# Altium schematic sheet DigitalV0.1.SchDoc
size A4; SheetNumber: 3; SheetTotal: 3
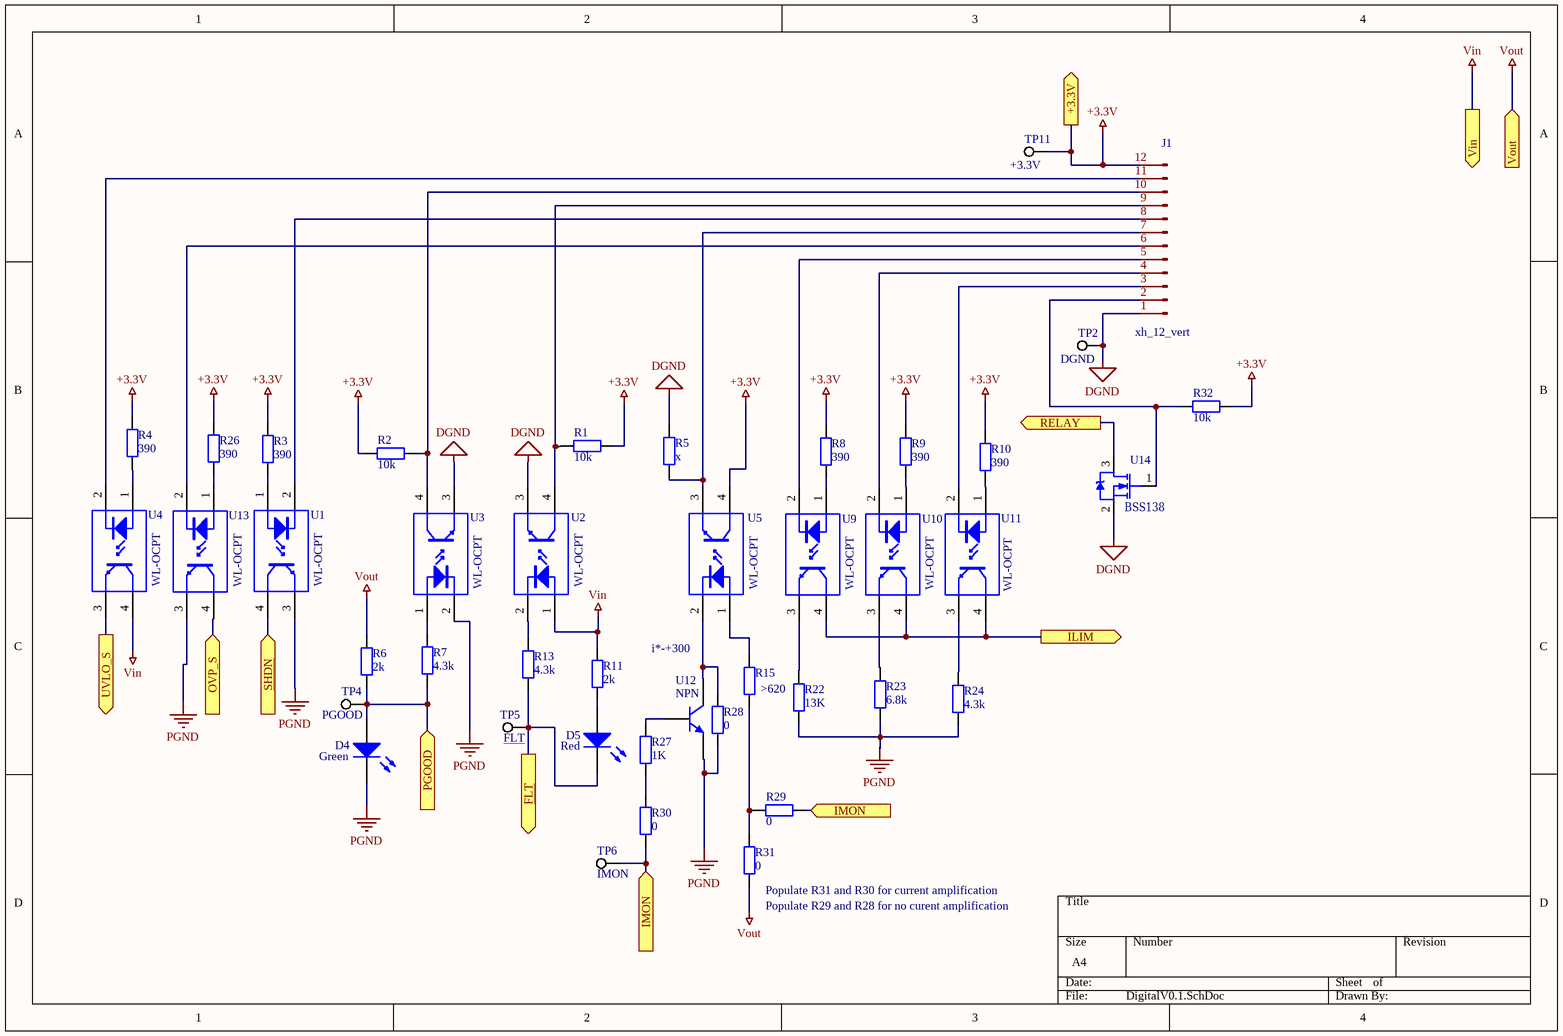
[diagram p0: DigitalV0.1.SchDoc]

## Parts
D4  Green  [0805 LED]
D5  Red  [0805 LED]
J1  xh_12_vert  [JST_XH_B12B-XH-A_1x12_P2.50mm_Vertical]
R1  10k  [0805]
R2  10k  [0805]
R3  390  [0805]
R4  390  [0805]
R5  x  [0805]
R6  2k  [0805]
R7  4.3k  [0805]
R8  390  [0805]
R9  390  [0805]
R10  390  [0805]
R11  2k  [0805]
R13  4.3k  [0805]
R15  >620  [0805]
R22  13K  [0805]
R23  6.8k  [0805]
R24  4.3k  [0805]
R26  390  [0805]
R27  1K  [0805]
R28  0  [0805]
R29  0  [0805]
R30  0  [0805]
R31  0  [0805]
R32  10k  [0805]
TP2  DGND  [Test Loop 1.6mm]
TP4  PGOOD  [Test Loop 1.6mm]
TP5  FLT  [Test Loop 1.6mm]
TP6  IMON  [Test Loop 1.6mm]
TP11  +3.3V  [Test Loop 1.6mm]
U1  WL-OCPT  [4-SOP_WE_opto-isolator]
U2  WL-OCPT  [4-SOP_WE_opto-isolator]
U3  WL-OCPT  [4-SOP_WE_opto-isolator]
U4  WL-OCPT  [4-SOP_WE_opto-isolator]
U5  WL-OCPT  [4-SOP_WE_opto-isolator]
U9  WL-OCPT  [4-SOP_WE_opto-isolator]
U10  WL-OCPT  [4-SOP_WE_opto-isolator]
U11  WL-OCPT  [4-SOP_WE_opto-isolator]
U12  NPN  [SOT23(TO-236AB)P095S230x290]
U13  WL-OCPT  [4-SOP_WE_opto-isolator]
U14  BSS138‎  [SOT-23-3]

## Ports
+3.3V (out), FLT (out), ILIM (out), IMON (in), OVP_S (in), PGOOD (in), RELAY (out), SHDN (in), UVLO_S (out), Vin (out), Vout (in)

## Nets
+3.3V: J1.12(Pin_11) R1.1 R2.1 R3.2 R4.2 R8.2 R9.2 R10.2 R26.2 R32.2 TP11.1 U5.4(C) ; port +3.3V
DGND: J1.1(Pin_1) R5.2 TP2.1 U2.3(E) U3.3(E) U14.2(D)
PGND: D4.2(K) R22.1 R23.1 R24.1 R28.2 U1.3(E) U3.2(C) U12.2(E) U13.3(E)
Vin: R11.2 U2.1(A) U4.4(C) ; port Vin
Vout: R6.2 R31.2 ; port Vout
FLT: D5.2(K) R13.1 TP5.1 ; port FLT
ILIM: U9.4(C) U10.4(C) U11.4(C) ; port ILIM
IMON: R29.1 R30.2 TP6.1 ; port IMON
OVP_S: U13.4(C) ; port OVP_S
PGOOD: D4.1(A) R6.1 R7.1 TP4.1 ; port PGOOD
RELAY: U14.3(S) ; port RELAY
SHDN: U1.4(C) ; port SHDN
UVLO_S: U4.3(E) ; port UVLO_S
NetD5_1: D5.1(A) R11.1
NetJ1_2: J1.2(Pin_2) R32.1 U14.1(G)
NetJ1_3: J1.3(Pin_3) U11.2(C)
NetJ1_4: J1.4(Pin_4) U10.2(C)
NetJ1_5: J1.5(Pin_5) U9.2(C)
NetJ1_6: J1.6(Pin_6) U13.2(C)
NetJ1_7: J1.7(Pin_7) R5.1 U5.3(E)
NetJ1_8: J1.8(Pin_8) U1.2(C)
NetJ1_9: J1.9(Pin_9) R1.2 U2.4(C)
NetJ1_10: J1.10(Pin_10) R2.2 U3.4(C)
NetJ1_11: J1.11(Pin_11) U4.2(C)
NetR3_1: R3.1 U1.1(A)
NetR4_1: R4.1 U4.1(A)
NetR7_2: R7.2 U3.1(A)
NetR8_1: R8.1 U9.1(A)
NetR9_1: R9.1 U10.1(A)
NetR10_1: R10.1 U11.1(A)
NetR13_2: R13.2 U2.2(C)
NetR15_1: R15.1 R29.2 R31.1
NetR15_2: R15.2 U5.1(A)
NetR22_2: R22.2 U9.3(E)
NetR23_2: R23.2 U10.3(E)
NetR24_2: R24.2 U11.3(E)
NetR26_1: R26.1 U13.1(A)
NetR27_1: R27.1 U12.1(B)
NetR27_2: R27.2 R30.1
NetR28_1: R28.1 U5.2(C) U12.3(C)

## Notes on the sheet
- i*-+300
- (near R31) Populate R29 and R28 for no curent amplification
- (near R31) Populate R31 and R30 for current amplification

## Library data of the parts
D4 D5 = LED
R1-R11 R13 R15 R22-R24 R26-R32 = res0805
TP2 TP4-TP6 TP11 = Test point
U1-U5 U9-U11 U13 = optoc WE
U14 = N-mosfet en